# EasyEDA schematic easyeda_aapen_term.json
TITLE: Pico Term; REV: 1.0; Date: 2025-01-22; Sheet: 1/1; Drawn By: russolsen; Company: AApen Industries
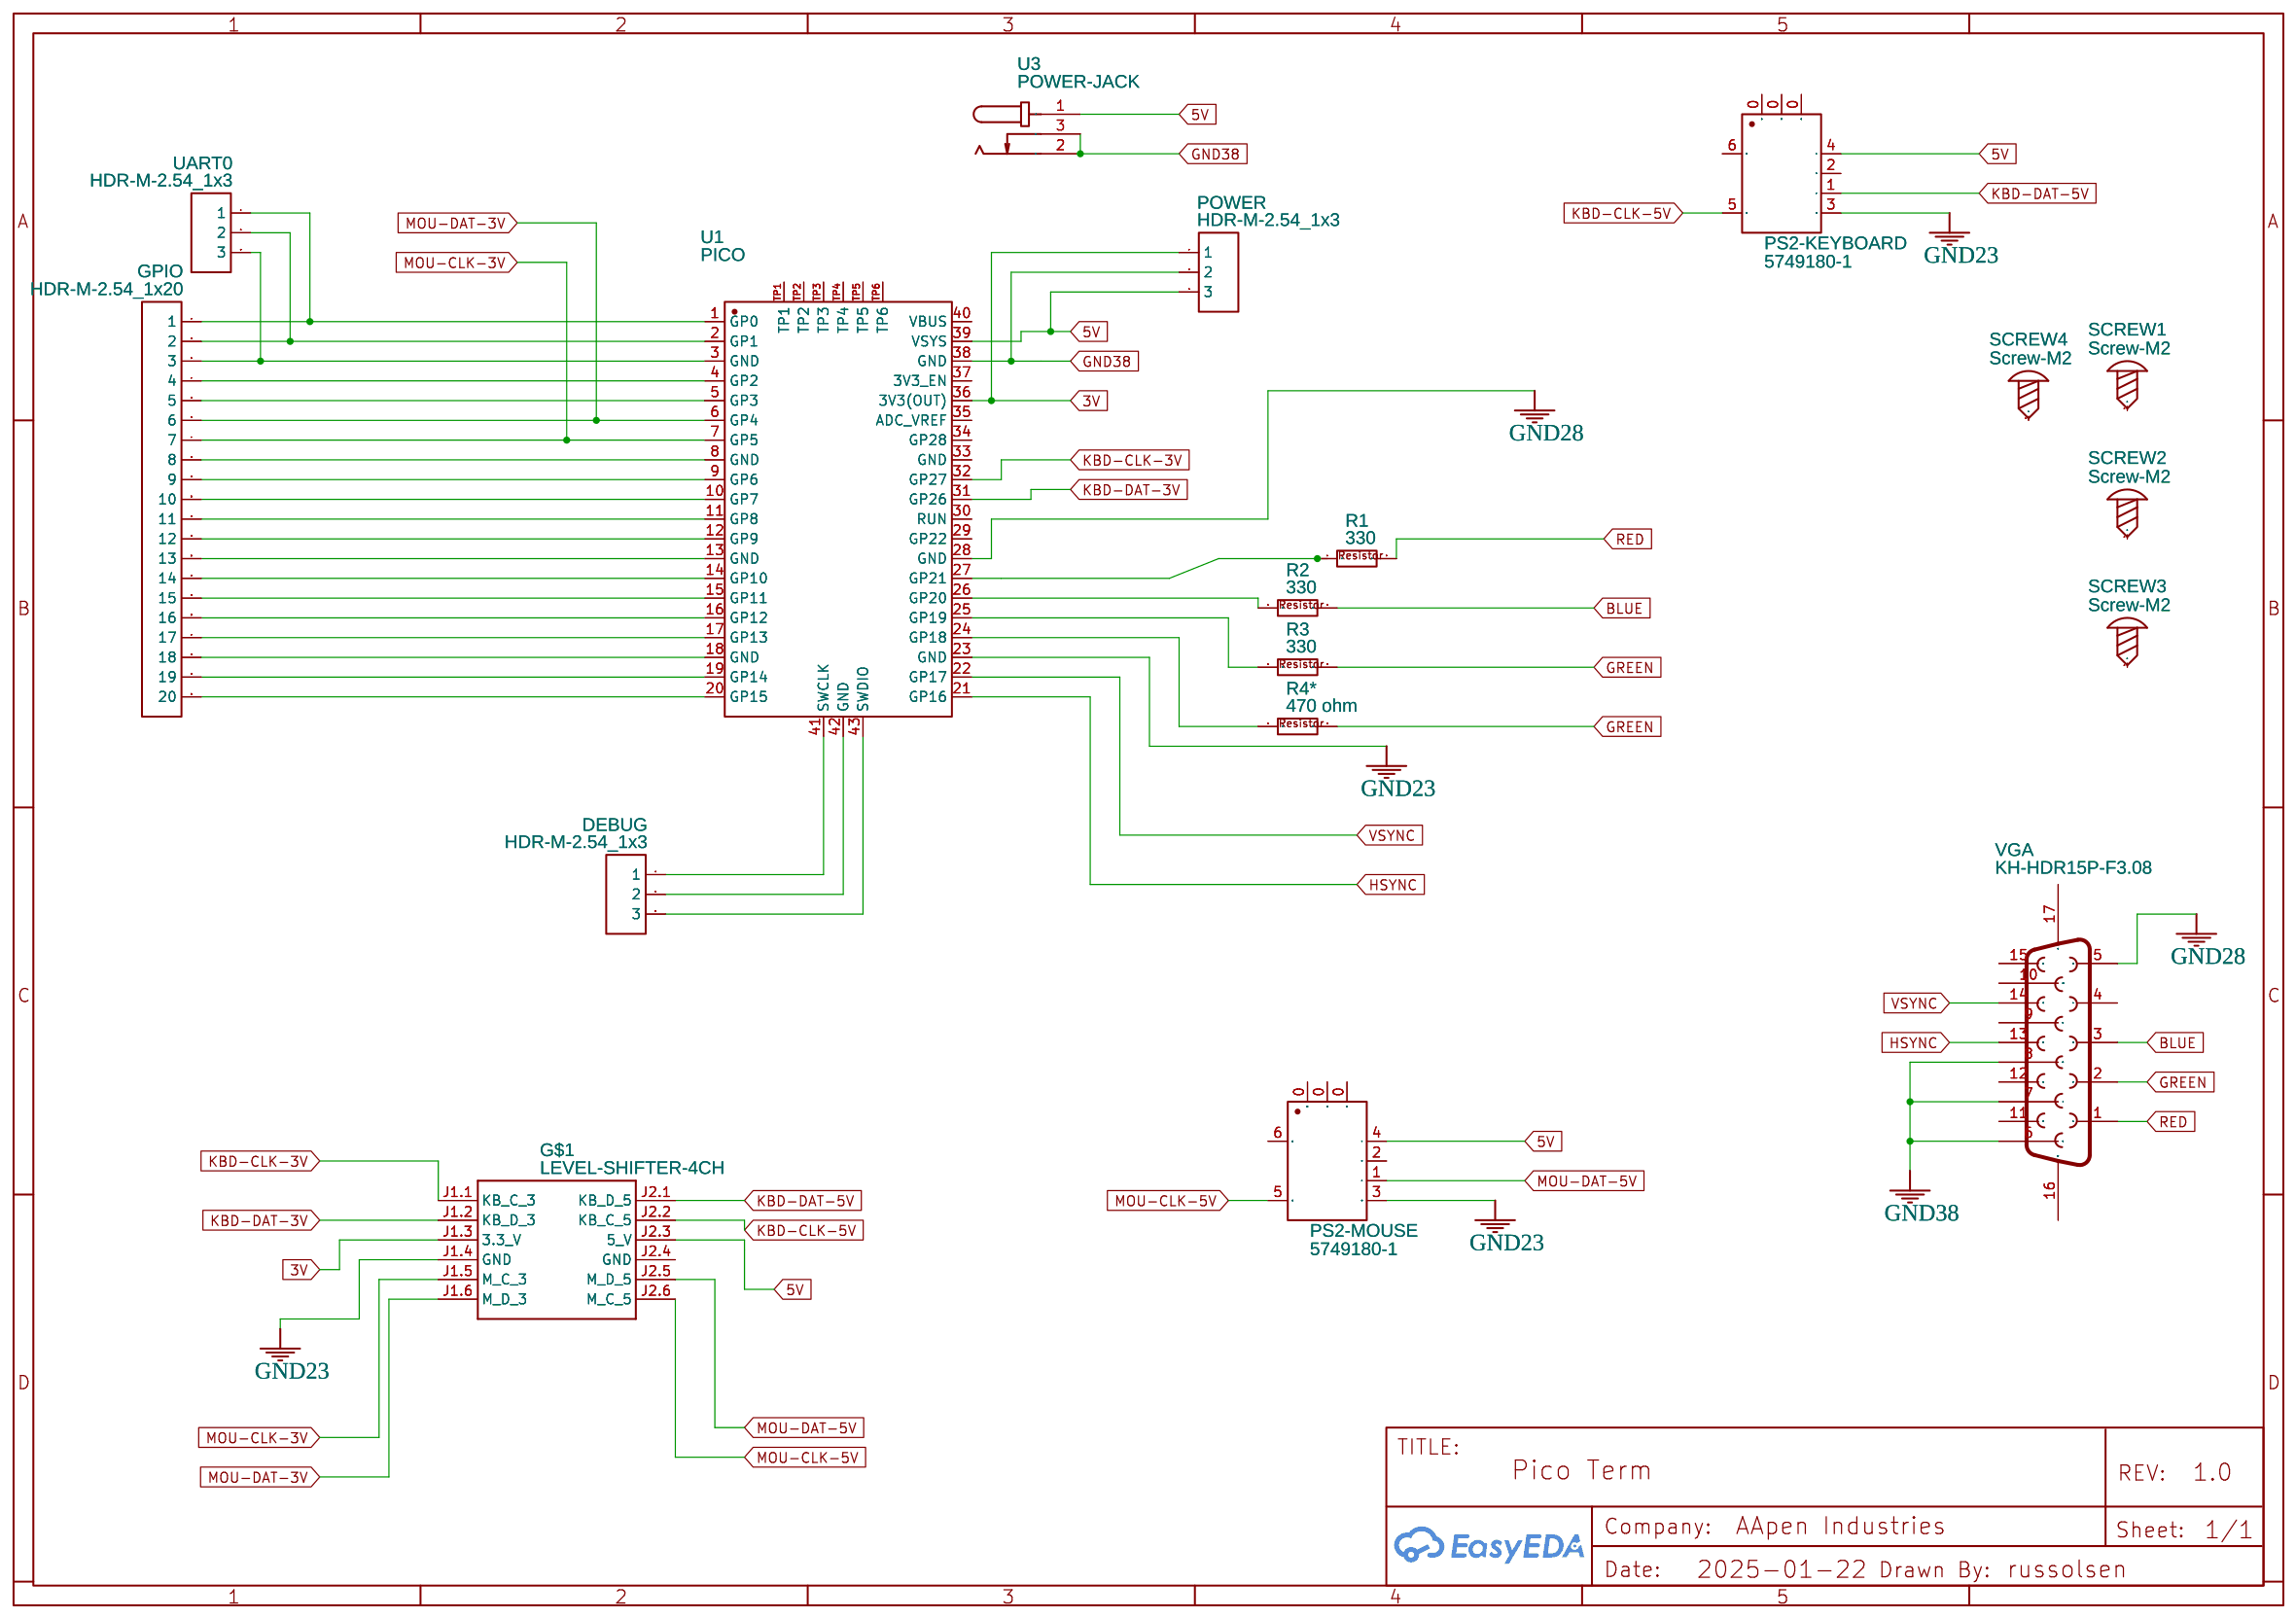
[diagram p0: schematic sheet]

## Parts
DEBUG  HDR-M-2.54_1x3  [HDR-M-2.54_1X3]
G$1  LEVEL-SHIFTER-4CH  [LEVEL-SHIFTER-4CH]
GPIO  HDR-M-2.54_1x20  [HDR-M-2.54_1X20]
POWER  HDR-M-2.54_1x3  [HDR-M-2.54_1X3]
PS2-KEYBOARD  5749180-1  [PS2-TH_6P-P2.05-S2.49_L12.8-W14.0-M]
PS2-MOUSE  5749180-1  [PS2-TH_6P-P2.05-S2.49_L12.8-W14.0-M]
R1  330  [AXIAL-0.6]
R2  330  [AXIAL-0.6]
R3  330  [AXIAL-0.6]
R4*  470 ohm  [AXIAL-0.6]
SCREW1  Screw-M2  [SCREW-M2]
SCREW2  Screw-M2  [SCREW-M2]
SCREW3  Screw-M2  [SCREW-M2]
SCREW4  Screw-M2  [SCREW-M2]
U1  PICO  [COMM-SMD_L51.0-W21.0-P2.54_SC0916]
U3  POWER-JACK  [DC-IN-TH_POWER-JACK]
UART0  HDR-M-2.54_1x3  [HDR-M-2.54_1X3]
VGA  KH-HDR15P-F3.08  [DSUB-TH_KH-HDR15P-F3.08-VGA]

## Library data of the parts
DEBUG POWER UART0 = HDR-M-2.54_1x3: Supplier Part: C180248; Supplier: LCSC; Contributor: LCEDA_Lib
G$1 = LEVEL-SHIFTER-4CH: Contributor: Ex T
GPIO = HDR-M-2.54_1x20: Supplier Part: C50981; Supplier: LCSC; Contributor: LCEDA_Lib
PS2-KEYBOARD PS2-MOUSE = 5749180-1: Contributor: LCSC; Supplier: LCSC; Supplier Part: C305986; Manufacturer: TE Connectivity(泰科电子); JLCPCB Part Class: Extended Part
R1-R3 R4* = Resistor: Supplier: LCSC; Supplier Part: C348838; Manufacturer: ResistorToday; Manufacturer Part: EWWR0001J20R0T9; Contributor: robosnake26
SCREW1-SCREW4 = Screw-M2: Contributor: EasyEDA
U1 = PICO: Supplier: LCSC; Supplier Part: C7203002; Manufacturer: Raspberry Pi(树莓派); JLCPCB Part Class: Extended Part; Contributor: lcsc
U3 = POWER-JACK: Contributor: LCSC; Supplier: LCSC; Supplier Part: C9900001795; Manufacturer: 索峰; JLCPCB Part Class: Extended Part
VGA = KH-HDR15P-F3.08: Supplier: LCSC; Supplier Part: C3038673; Manufacturer: kinghelm(金航标); Contributor: lcsc; JLCPCB Part Class: Extended Part

## Nets
3V: G$1.J1.3(3.3 V) POWER.1 U1.36(3V3(OUT))
5V: G$1.J2.3(5 V) POWER.3 PS2-KEYBOARD.4 PS2-MOUSE.4 U1.39(VSYS) U3.1
GND23: G$1.J1.4(GND) PS2-KEYBOARD.3 PS2-MOUSE.3 U1.23(GND)
GND28: U1.28(GND) VGA.5
GND38: POWER.2 U1.38(GND) U3.2 U3.3 VGA.6 VGA.7 VGA.8
BLUE: R2.2 VGA.3
GREEN: R3.2 R4*.2 VGA.2
HSYNC: U1.21(GP16) VGA.13
KBD-CLK-3V: G$1.J1.1(KB C 3) U1.32(GP27)
KBD-CLK-5V: G$1.J2.2(KB C 5) PS2-KEYBOARD.5
KBD-DAT-3V: G$1.J1.2(KB D 3) U1.31(GP26)
KBD-DAT-5V: G$1.J2.1(KB D 5) PS2-KEYBOARD.1
MOU-CLK-3V: G$1.J1.5(M C 3) GPIO.7 U1.7(GP5)
MOU-CLK-5V: G$1.J2.6(M C 5) PS2-MOUSE.5
MOU-DAT-3V: G$1.J1.6(M D 3) GPIO.6 U1.6(GP4)
MOU-DAT-5V: G$1.J2.5(M D 5) PS2-MOUSE.1
RED: R1.2 VGA.1
VSYNC: U1.22(GP17) VGA.14
Net-(DEBUG-1): DEBUG.1 U1.41(SWCLK)
Net-(DEBUG-2): DEBUG.2 U1.42(GND)
Net-(DEBUG-3): DEBUG.3 U1.43(SWDIO)
Net-(GPIO-1): GPIO.1 U1.1(GP0) UART0.1
Net-(GPIO-2): GPIO.2 U1.2(GP1) UART0.2
Net-(GPIO-3): GPIO.3 U1.3(GND) UART0.3
Net-(GPIO-4): GPIO.4 U1.4(GP2)
Net-(GPIO-5): GPIO.5 U1.5(GP3)
Net-(GPIO-8): GPIO.8 U1.8(GND)
Net-(GPIO-9): GPIO.9 U1.9(GP6)
Net-(GPIO-10): GPIO.10 U1.10(GP7)
Net-(GPIO-11): GPIO.11 U1.11(GP8)
Net-(GPIO-12): GPIO.12 U1.12(GP9)
Net-(GPIO-13): GPIO.13 U1.13(GND)
Net-(GPIO-14): GPIO.14 U1.14(GP10)
Net-(GPIO-15): GPIO.15 U1.15(GP11)
Net-(GPIO-16): GPIO.16 U1.16(GP12)
Net-(GPIO-17): GPIO.17 U1.17(GP13)
Net-(GPIO-18): GPIO.18 U1.18(GND)
Net-(GPIO-19): GPIO.19 U1.19(GP14)
Net-(GPIO-20): GPIO.20 U1.20(GP15)
Net-(R1-1): R1.1 U1.27(GP21)
Net-(R2-1): R2.1 U1.26(GP20)
Net-(R3-1): R3.1 U1.25(GP19)
Net-(R4*-1): R4*.1 U1.24(GP18)

Not connected (* = marked no-connect by the designer): G$1 J2.4(GND); PS2-KEYBOARD 0 2 6; PS2-MOUSE 0 2 6; SCREW1 1; SCREW2 1; SCREW3 1; SCREW4 1; U1 29(GP22) 30(RUN) 33(GND) 34(GP28) 35(ADC_VREF) 37(3V3_EN) 40(VBUS) TP1 TP2 TP3 TP4 TP5 TP6; VGA 4 9 10 11 12 15 16 17
